# EAGLE design main_v4 (EAGLE 6.3)
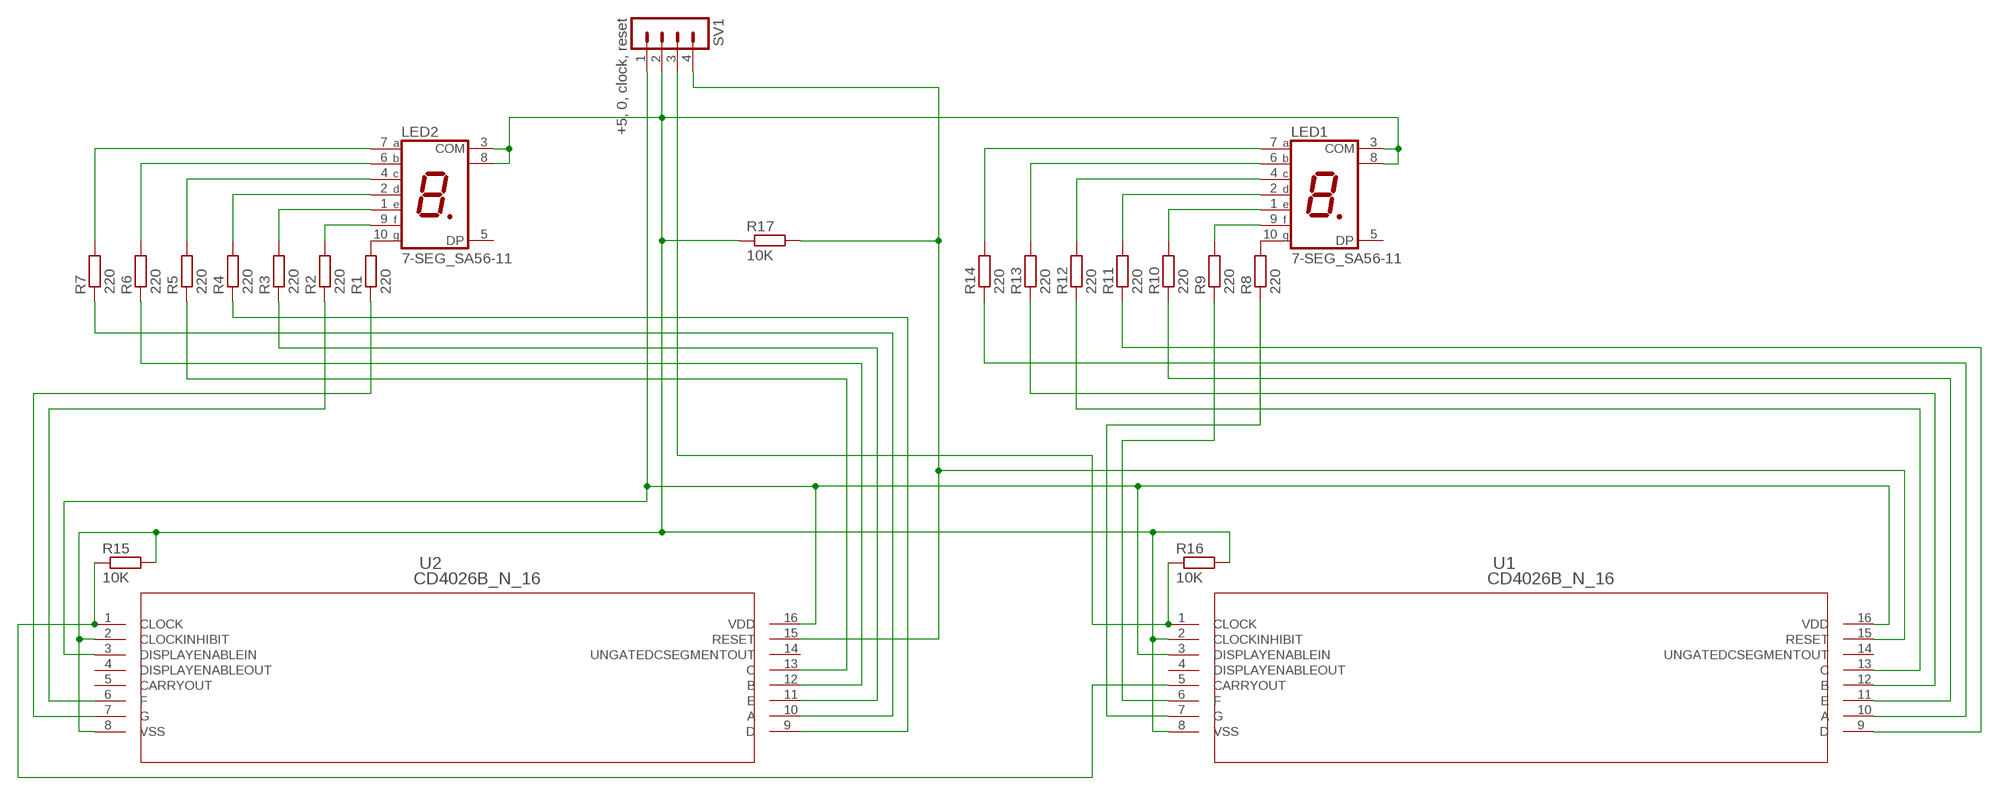
[diagram p0: schematic, sheet 1]

## Parts
LED1  7-SEG_SA56-11  [SA56-11]
LED2  7-SEG_SA56-11  [SA56-11]
R1  220  R-EU_R0805  [R0805]
R2  220  R-EU_R0805  [R0805]
R3  220  R-EU_R0805  [R0805]
R4  220  R-EU_R0805  [R0805]
R5  220  R-EU_R0805  [R0805]
R6  220  R-EU_R0805  [R0805]
R7  220  R-EU_R0805  [R0805]
R8  220  R-EU_R0805  [R0805]
R9  220  R-EU_R0805  [R0805]
R10  220  R-EU_R0805  [R0805]
R11  220  R-EU_R0805  [R0805]
R12  220  R-EU_R0805  [R0805]
R13  220  R-EU_R0805  [R0805]
R14  220  R-EU_R0805  [R0805]
R15  10K  R-EU_R0805  [R0805]
R16  10K  R-EU_R0805  [R0805]
R17  10K  R-EU_R0805  [R0805]
SV1  +5, 0, clock, reset  MA04-1  [MA04-1]
U1  CD4026B_N_16  [N16]
U2  CD4026B_N_16  [N16]

## Nets
N$1: LED2.10(G) R1.2
N$2: LED2.9(F) R2.2
N$3: LED2.1(E) R3.2
N$4: LED2.2(D) R4.2
N$5: LED2.4(C) R5.2
N$6: LED2.6(B) R6.2
N$7: LED2.7(A) R7.2
N$8: SV1.1 U1.3(DISPLAYENABLEIN) U1.16(VDD) U2.3(DISPLAYENABLEIN) U2.16(VDD)
N$9: LED1.3(COM) LED1.8(COM) LED2.3(COM) LED2.8(COM) R15.2 R16.2 R17.1 SV1.2 U1.2(CLOCKINHIBIT) U1.8(VSS) U2.2(CLOCKINHIBIT) U2.8(VSS)
N$10: LED1.10(G) R8.2
N$11: LED1.9(F) R9.2
N$12: LED1.1(E) R10.2
N$13: LED1.2(D) R11.2
N$14: LED1.4(C) R12.2
N$15: LED1.6(B) R13.2
N$16: LED1.7(A) R14.2
N$17: R16.1 SV1.3 U1.1(CLOCK)
N$18: R7.1 U2.10(A)
N$19: R6.1 U2.12(B)
N$20: R17.2 SV1.4 U1.15(RESET) U2.15(RESET)
N$21: R5.1 U2.13(C)
N$22: R4.1 U2.9(D)
N$23: R3.1 U2.11(E)
N$24: R2.1 U2.6(F)
N$25: R1.1 U2.7(G)
N$27: R15.1 U1.5(CARRYOUT) U2.1(CLOCK)
N$28: R9.1 U1.6(F)
N$29: R8.1 U1.7(G)
N$30: R12.1 U1.13(C)
N$31: R13.1 U1.12(B)
N$32: R10.1 U1.11(E)
N$33: R14.1 U1.10(A)
N$34: R11.1 U1.9(D)
Unconnected: LED1.5(DP) LED2.5(DP) U1.4(DISPLAYENABLEOUT) U1.14(UNGATEDCSEGMENTOUT) U2.4(DISPLAYENABLEOUT) U2.5(CARRYOUT) U2.14(UNGATEDCSEGMENTOUT)

## Library data of the parts
LED1 LED2 = display-kingbright:7-SEG_: Kingbright 14.2mm (0.56 INCH) SINGLE DIGIT NUMERIC DUISPLAY Source: SA56-11EWA(Ver1189471036.pdf; OC_FARNELL: unknown; OC_NEWARK: unknown
R1-R17 = resistor:R-EU_: RESISTOR, European symbol
SV1 = con-lstb:MA04-1: PIN HEADER; OC_FARNELL: unknown; OC_NEWARK: unknown
U1 U2 = CD4026:CD4026B_N_16; DATASHEETURL: http://www.ti.com/lit/gpn/CD4026B; DESCRIPTION: CMOS Decade Counter/Divider with Decoded 7-Segment Display Outputs and Display Enable; FAMILY_NAME: DECADE COUNTER; GENERIC_PART_NUMBER: CD4026B; INDUSTRY_STD_PKG_TYPE: PDIP; MANUFACTURER: Texas Instruments; PACKAGE_DESIGNATOR: N; PIN_COUNT: 16

## Board
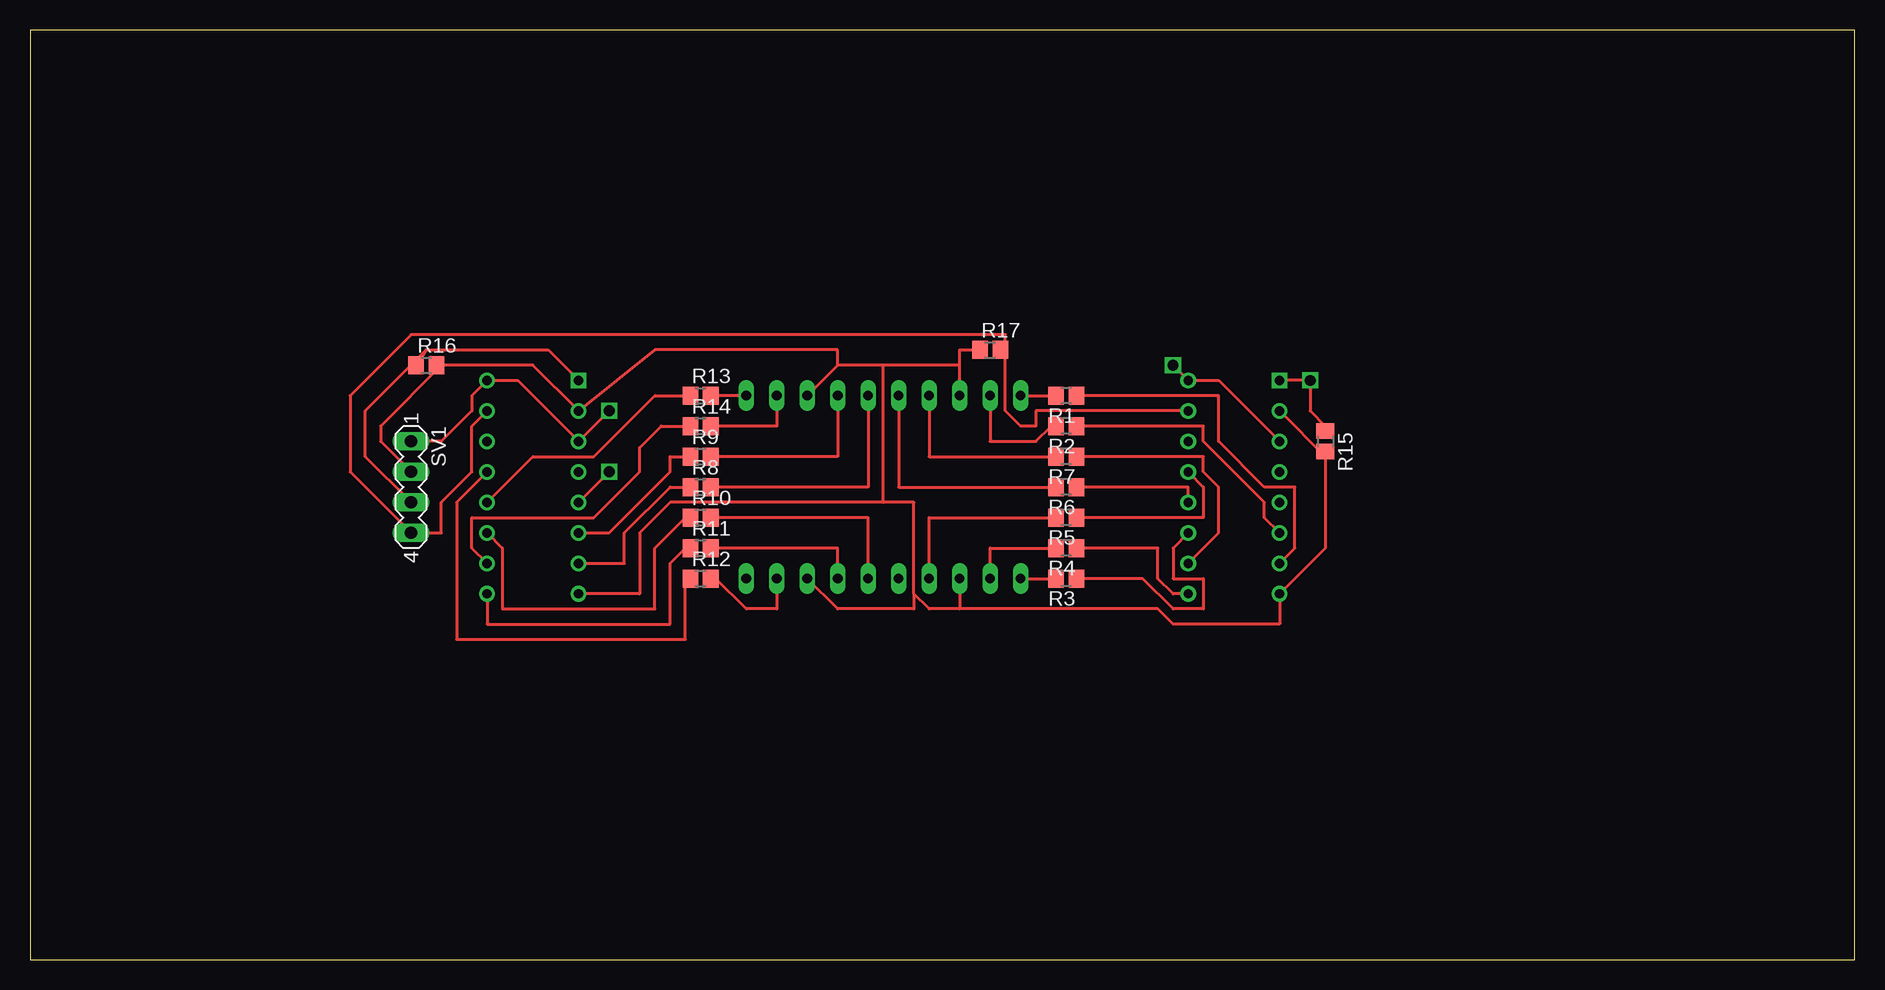
[diagram p1: board, top side]
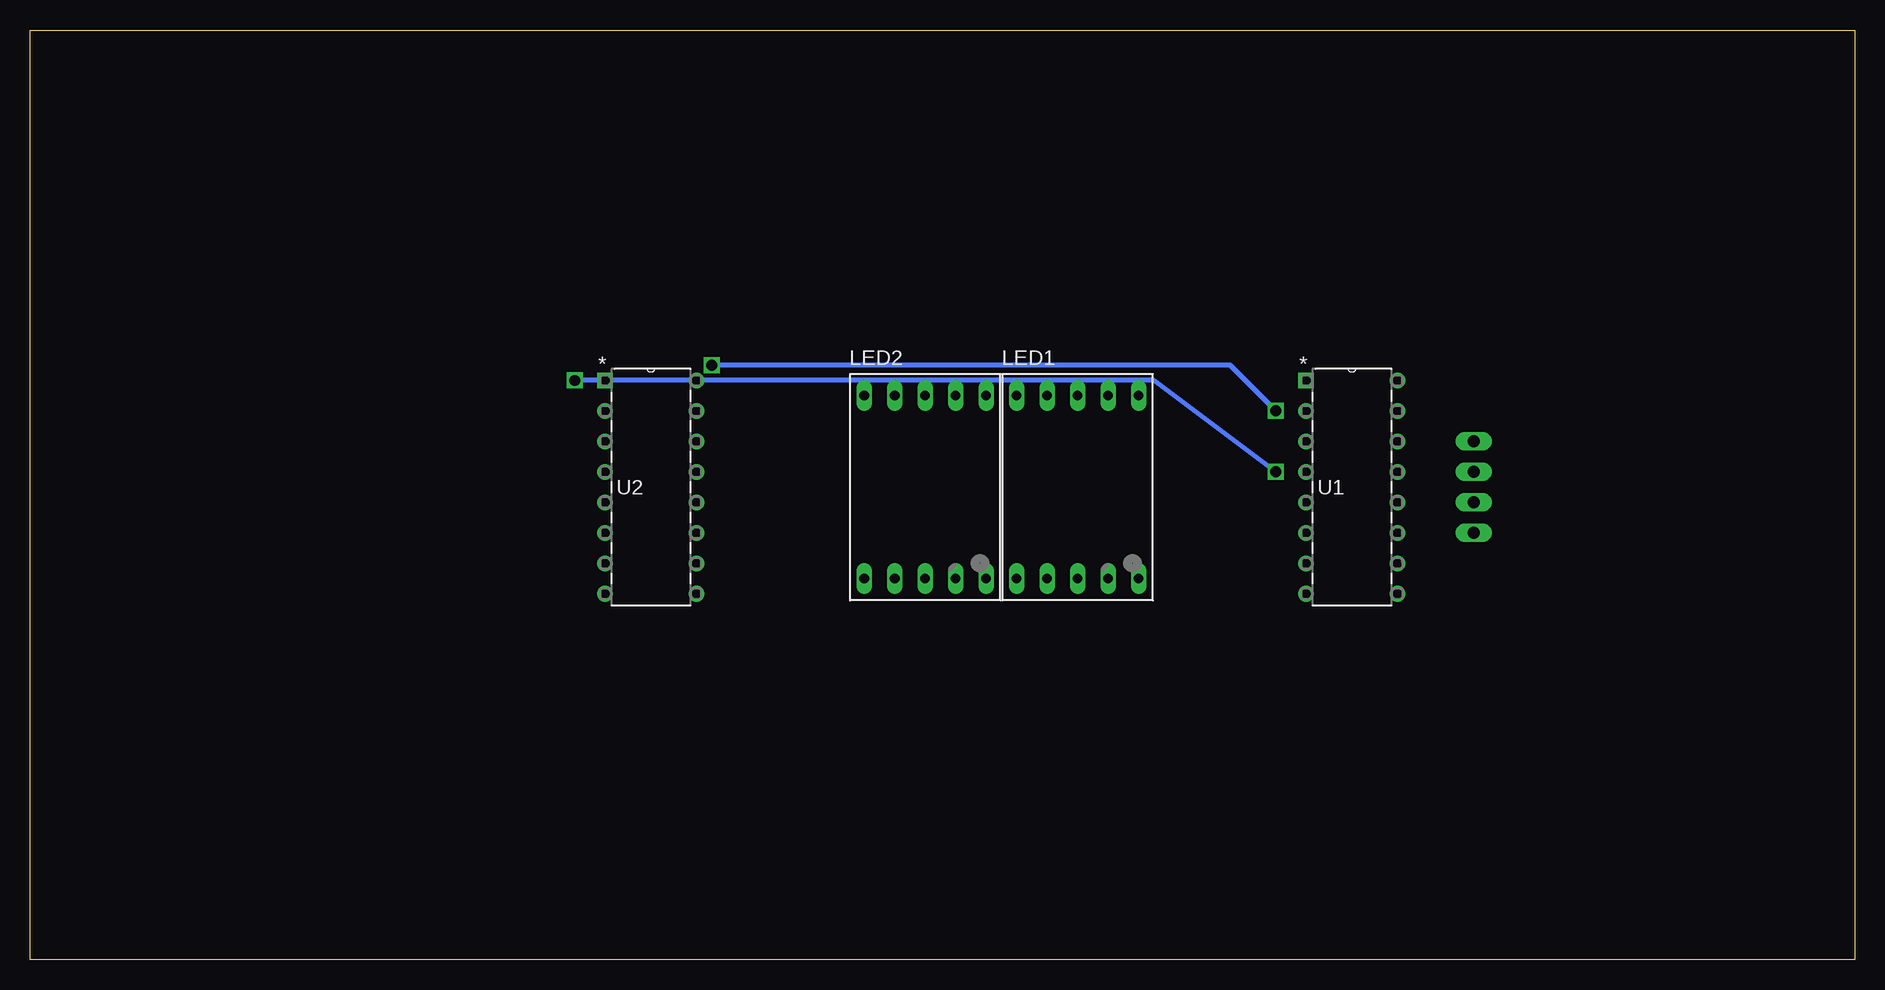
[diagram p2: board, bottom side, seen from below]

Size 152.07 x 77.46 mm. Coordinates in mm from the lower left corner, seen from the top.
Outline: 0,0 152.07,0 152.07,77.46 0,77.46 0,0
Copper layers (1*16): Top 0.035mm / dielectric 1.5mm / Bottom 0.035mm
Design rules "default": minimum track width 10mil, minimum drill 24mil, track to track 8mil, track to pad 8mil, pad to pad 8mil, via to via 8mil, smd to smd 8mil, copper to edge 40mil, drill to drill 8mil, minimum pad ring 10mil, minimum via ring 8mil, stop-mask expansion 4mil, vias tented up to drill 0mil, thermal gap 10mil

### Footprints (pad centres in the part's own frame; a part is rotated, then mirrored left to right if it is on the bottom)
SA56-11 = drill 0.8 long: 1 -5.08,-7.62; 2 -2.54,-7.62; 3 0,-7.62; 4 2.54,-7.62; 5 5.08,-7.62; 6 5.08,7.62; 7 2.54,7.62; 8 0,7.62; 9 -2.54,7.62; 10 -5.08,7.62
R0805 = smd 1.3 x 1.5: 1 -0.85,0; 2 0.85,0
MA04-1 = drill 1.016 long: 1 -3.81,0; 2 -1.27,0; 3 1.27,0; 4 3.81,0
N16 = drill 0.787 square: 1 -7.62,17.78 | drill 0.787: 2 -7.62,15.24; 3 -7.62,12.7; 4 -7.62,10.16; 5 -7.62,7.62; 6 -7.62,5.08; 7 -7.62,2.54; 8 -7.62,0; 9 0,0; 10 0,2.54; 11 0,5.08; 12 0,7.62; 13 0,10.16; 14 0,12.7; 15 0,15.24; 16 0,17.78

### Placement (x,y rotation side)
LED1  64.77,39.37 0 bottom
LED2  77.47,39.37 0 bottom
R1  86.36,46.99 180 top
R2  86.36,44.45 180 top
R3  86.36,31.75 180 top
R4  86.36,34.29 180 top
R5  86.36,36.83 180 top
R6  86.36,39.37 180 top
R7  86.36,41.91 180 top
R8  55.88,39.37 0 top
R9  55.88,41.91 0 top
R10  55.88,36.83 0 top
R11  55.88,34.29 0 top
R12  55.88,31.75 0 top
R13  55.88,46.99 0 top
R14  55.88,44.45 0 top
R15  107.95,43.18 270 top
R16  33.02,49.53 0 top
R17  80.01,50.8 0 top
SV1  31.75,39.37 270 top
U1  38.1,30.48 0 bottom
U2  96.52,30.48 0 bottom

### Tracks (layer width: path | path; a pad name or v marks a point on that pad's centre or on a via)
N$1
  Top 0.254: LED2.10 R1.2
N$2
  Top 0.254: LED2.9 80.01,43.18 83.82,43.18 85.09,44.45 R2.2
N$3
  Top 0.254: LED2.1 R3.2
N$4
  Top 0.254: R4.2 80.01,34.29 LED2.2
N$5
  Top 0.254: R5.2 74.93,36.83 LED2.4
N$6
  Top 0.254: R6.2 72.39,39.37 LED2.6
N$7
  Top 0.254: R7.2 74.93,41.91 LED2.7
N$8  (via drill 0.9)
  Top 0.254: U2.3 99.06,48.26 U2.16 v95.25,49.53 | SV1.1 34.29,43.18 36.83,45.72 36.83,46.99 U1.16 40.64,48.26 U1.3 v48.26,45.72
  Bottom 0.406: v48.26,45.72 52.07,49.53 v95.25,49.53
N$9
  Top 0.254: 67.31,49.53 LED1.8 | 77.47,49.53 71.12,49.53 | 71.12,49.53 67.31,49.53 | LED2.8 77.47,49.53 | U1.8 50.8,30.48 50.8,35.56 53.34,38.1 71.12,38.1 | 71.12,38.1 73.66,38.1 73.66,30.48 | 73.66,30.48 74.93,29.21 77.47,29.21 | LED2.3 77.47,29.21 | LED1.3 67.31,29.21 73.66,29.21 73.66,30.48 | 71.12,38.1 71.12,49.53 | 77.47,29.21 93.98,29.21 95.25,27.94 104.14,27.94 U2.8 107.95,34.29 107.95,41.91 | R17.1 77.47,50.8 77.47,49.53 | U2.2 107.95,41.91 | 107.95,41.91 R15.2 | 67.31,49.53 67.31,50.8 52.07,50.8 U1.2 41.91,49.53 34.29,49.53 | SV1.2 29.21,43.18 29.21,44.45 34.29,49.53 | 34.29,49.53 R16.2
N$10
  Top 0.254: R8.2 69.85,39.37 LED1.10
N$11
  Top 0.254: R9.2 67.31,41.91 LED1.9
N$12
  Top 0.254: R10.2 69.85,36.83 LED1.1
N$13
  Top 0.254: R11.2 67.31,34.29 LED1.2
N$14
  Top 0.254: LED1.4 62.23,29.21 59.69,29.21 57.15,31.75 R12.2
N$15
  Top 0.254: LED1.6 R13.2
N$16
  Top 0.254: R14.2 62.23,44.45 LED1.7
N$17
  Top 0.254: 33.02,50.8 27.94,45.72 27.94,41.91 SV1.3 | U1.1 43.18,50.8 33.02,50.8 | 33.02,50.8 R16.1
N$18
  Top 0.254: R7.1 97.79,41.91 97.79,40.64 99.06,39.37 99.06,35.56 U2.10
N$19
  Top 0.254: R6.1 96.52,39.37 U2.12
N$20
  Top 0.254: U1.15 36.83,44.45 36.83,40.64 34.29,38.1 34.29,35.56 SV1.4 26.67,40.64 26.67,46.99 31.75,52.07 81.28,52.07 81.28,50.8 | 81.28,50.8 81.28,45.72 82.55,44.45 83.82,44.45 83.82,45.72 U2.15 | 81.28,50.8 R17.2
N$21
  Top 0.254: R5.1 97.79,36.83 97.79,39.37 U2.13
N$22
  Top 0.254: R4.1 93.98,34.29 93.98,31.75 95.25,30.48 U2.9
N$23
  Top 0.254: R3.1 92.71,31.75 95.25,29.21 97.79,29.21 97.79,31.75 95.25,31.75 95.25,34.29 U2.11
N$24
  Top 0.254: R2.1 97.79,44.45 97.79,43.18 102.87,38.1 102.87,36.83 U2.6
N$25
  Top 0.254: R1.1 99.06,46.99 99.06,43.18 102.87,39.37 105.41,39.37 105.41,34.29 U2.7
N$27  (via drill 0.9)
  Top 0.254: U1.5 v48.26,40.64 | U2.1 v106.68,48.26 106.68,45.72 107.95,44.45 R15.1
  Bottom 0.406: v48.26,40.64 58.42,48.26 v106.68,48.26
N$28
  Top 0.254: R9.1 53.34,41.91 53.34,40.64 48.26,35.56 U1.6
N$29
  Top 0.254: R8.1 53.34,39.37 49.53,35.56 49.53,33.02 U1.7
N$30
  Top 0.254: U1.13 35.56,38.1 35.56,26.67 54.61,26.67 54.61,31.75 R12.1
N$31
  Top 0.254: R13.1 52.07,46.99 46.99,41.91 41.91,41.91 U1.12
N$32
  Top 0.254: U1.11 39.37,34.29 39.37,29.21 52.07,29.21 52.07,34.29 54.61,36.83 R10.1
N$33
  Top 0.254: R14.1 52.6,44.45 50.8,42.65 50.8,40.64 46.99,36.83 36.83,36.83 36.83,34.29 U1.10
N$34
  Top 0.254: U1.9 38.1,27.94 53.34,27.94 53.34,33.02 54.61,34.29 R11.1